# EasyEDA Pro project pcb入门（R标哨兵小周边）.epro

# Schematic Schematic2
Board Name: 上板; Create Date: 2024-09-23; Page Name: P1; Project Name: 新生培训——pcb入门（装甲板小周边）; Schematic Name: Schematic2; Update Date: 2024-09-23; Company: 嘉立创EDA; Page Size: A4; Version: V1.0
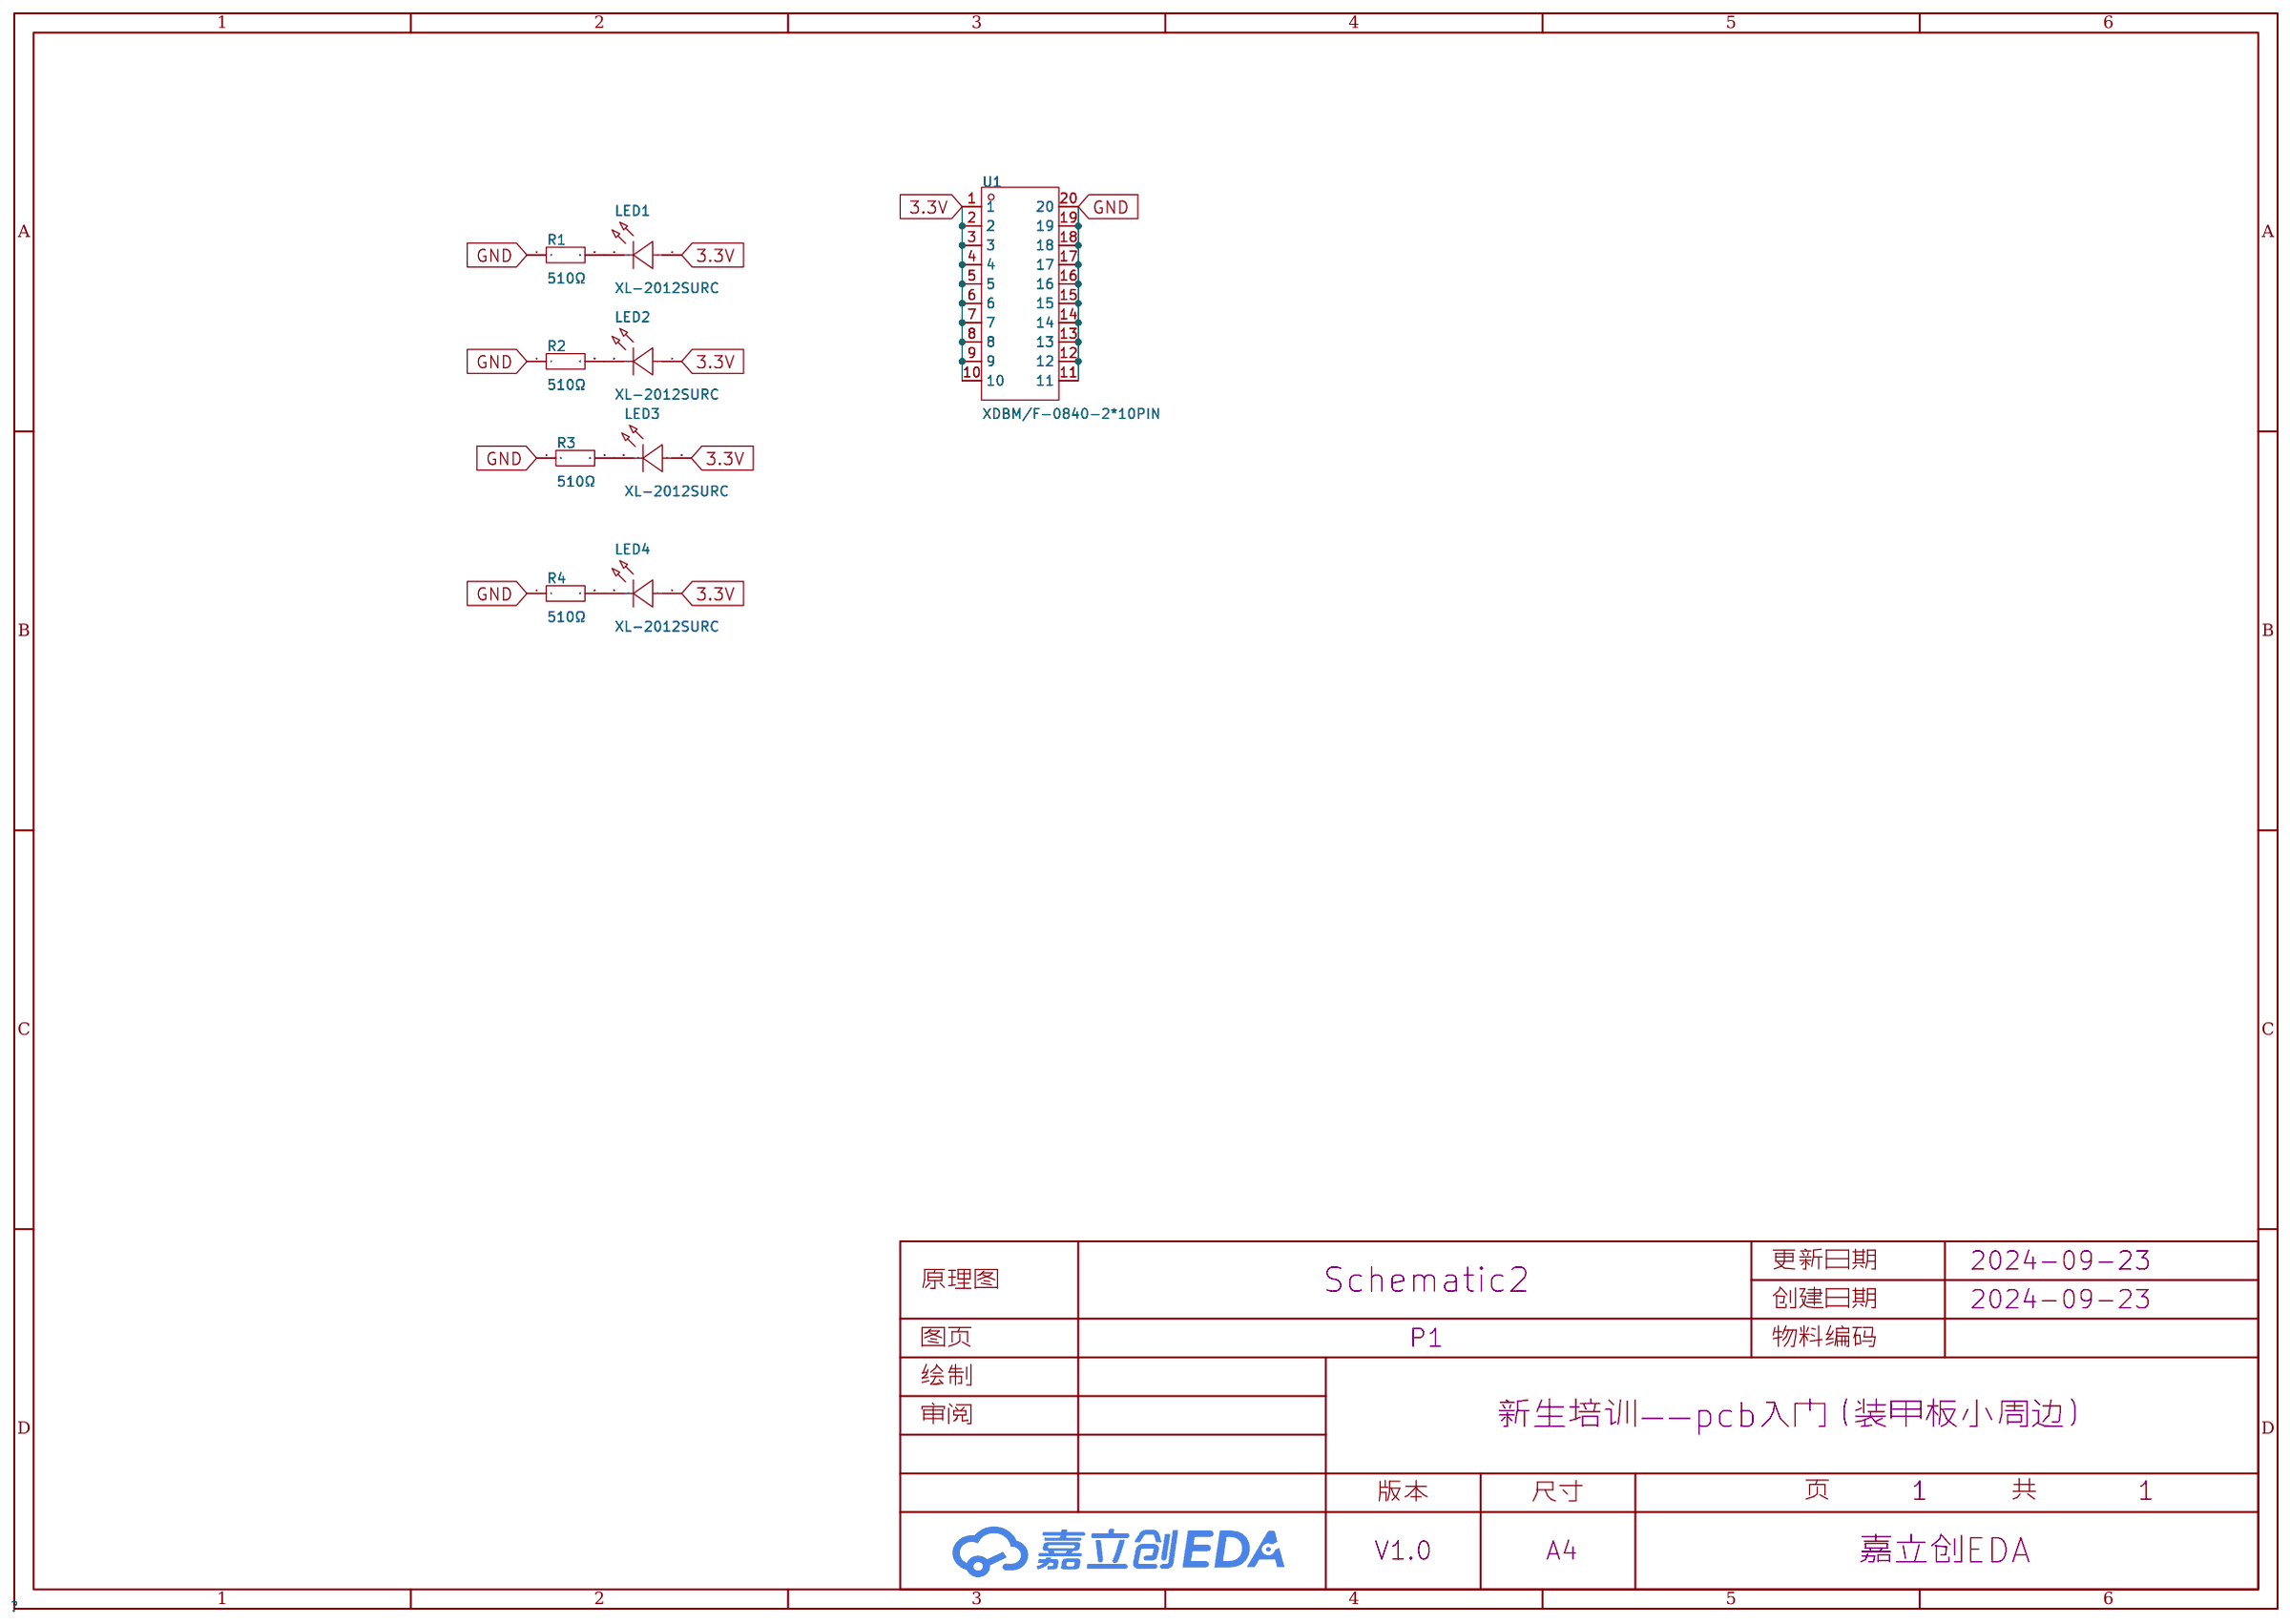
[diagram p0: schematic sheet]

## Parts
LED1  XL-2012SURC  [LED0805-R-RD]
LED2  XL-2012SURC  [LED0805-R-RD]
LED3  XL-2012SURC  [LED0805-R-RD]
LED4  XL-2012SURC  [LED0805-R-RD]
R1  510Ω  [R0805]
R2  510Ω  [R0805]
R3  510Ω  [R0805]
R4  510Ω  [R0805]
U1  XDBM/F-0840-2*10PIN  [CONN-SMD_20P-P0.80_LB340G20SBOR]

## Library data of the parts
LED1-LED4 = XL-2012SURC: 发光颜色:红色;功率:55mW;正向电流:25mA;主波长:617nm~621nm;透镜颜色:无色透明透镜;色温:-;发光角度:120°;载带方式:正贴;工作温度:-30℃~+85℃;; Supplier Part: C965812; Manufacturer: XINGLIGHT(成兴光); Supplier Footprint: 0805; JLCPCB Part Class: 扩展库; Datasheet: https://atta.szlcsc.com/upload/public/pdf/source/20221102/49E1A0A365644091E6270AF1C5E0FE37.pdf; Supplier: LCSC; Emitted Color: 红色; Power Dissipation: 55mW; Forward Current: 25mA; Dominant Wavelength: 617nm~621nm; Peak Wavelength: 623nm; Lens Color: 无色透明透镜; Viewing Angle: 120°; Mounting Sytle: 正贴; Operating Temperature: -30℃~+85℃
R1-R4 = 0805W8F5100T5E: 电阻类型:厚膜电阻;阻值:510Ω;精度:±1%;功率:125mW;最大工作电压:150V;温度系数:±100ppm/℃;; LCSC Part Name: 510Ω ±1% 125mW 厚膜电阻; Supplier Part: C17734; Manufacturer: UNI-ROYAL(厚声); Supplier Footprint: 0805; JLCPCB Part Class: 基础库; Datasheet: https://atta.szlcsc.com/upload/public/pdf/source/20200306/C422600_1E6D84923E4A46A82E41ADD87F860B5C.pdf; Supplier: LCSC; Type: 厚膜电阻; Tolerance: ±1%; Power(Watts): 125mW; Overload Voltage (Max): 150V; Temperature Coefficient: ±100ppm/℃; Operating Temperature Range: -55℃~+155℃
U1 = XDBM/F-0840-2*10PIN: PIN总数:20P;间距:0.8mm;安装方式:立贴;行数:2;额定电流:500mA;工作温度范围:-45℃~+80℃;; LCSC Part Name: 板对板连接器@@BTB板对板PH0.8-2*10PIN公母座合高4.0MM 二件套 2件套; Supplier Part: C19626263; Manufacturer: LX(连欣科技); Supplier Footprint: SMD,P=0.8mm; JLCPCB Part Class: Extended Part; Datasheet: https://atta.szlcsc.com/upload/public/pdf/source/20231208/7FD466011FDB41C6190E2B65EF865205.pdf; Supplier: LCSC; Number of Pins: 20P; Pitch: 0.8mm; Mounting Style: 立贴; Number of Rows: 2; Current Rating (Max): 500mA; Contact Material: 铜; Contact Plating: 金; Operating Temperature Range: -45℃~+80℃

## Nets
3.3V: LED1.1(A) LED2.1(A) LED3.1(A) LED4.1(A) U1.1 U1.2 U1.3 U1.4 U1.5 U1.6 U1.7 U1.8 U1.9 U1.10
GND: R1.1 R2.1 R3.1 R4.1 U1.11 U1.12 U1.13 U1.14 U1.15 U1.16 U1.17 U1.18 U1.19 U1.20
$1N489: LED1.2(K) R1.2
$1N651: LED2.2(K) R2.2
$1N756: LED3.2(K) R3.2
$1N861: LED4.2(K) R4.2

# Schematic Schematic1
Board Name: 下板; Create Date: 2024-09-08; Page Name: P1; Project Name: 新生培训——pcb入门（装甲板小周边）; Schematic Name: Schematic1; Update Date: 2024-09-23; Company: 嘉立创EDA; Page Size: A4; Version: V1.0
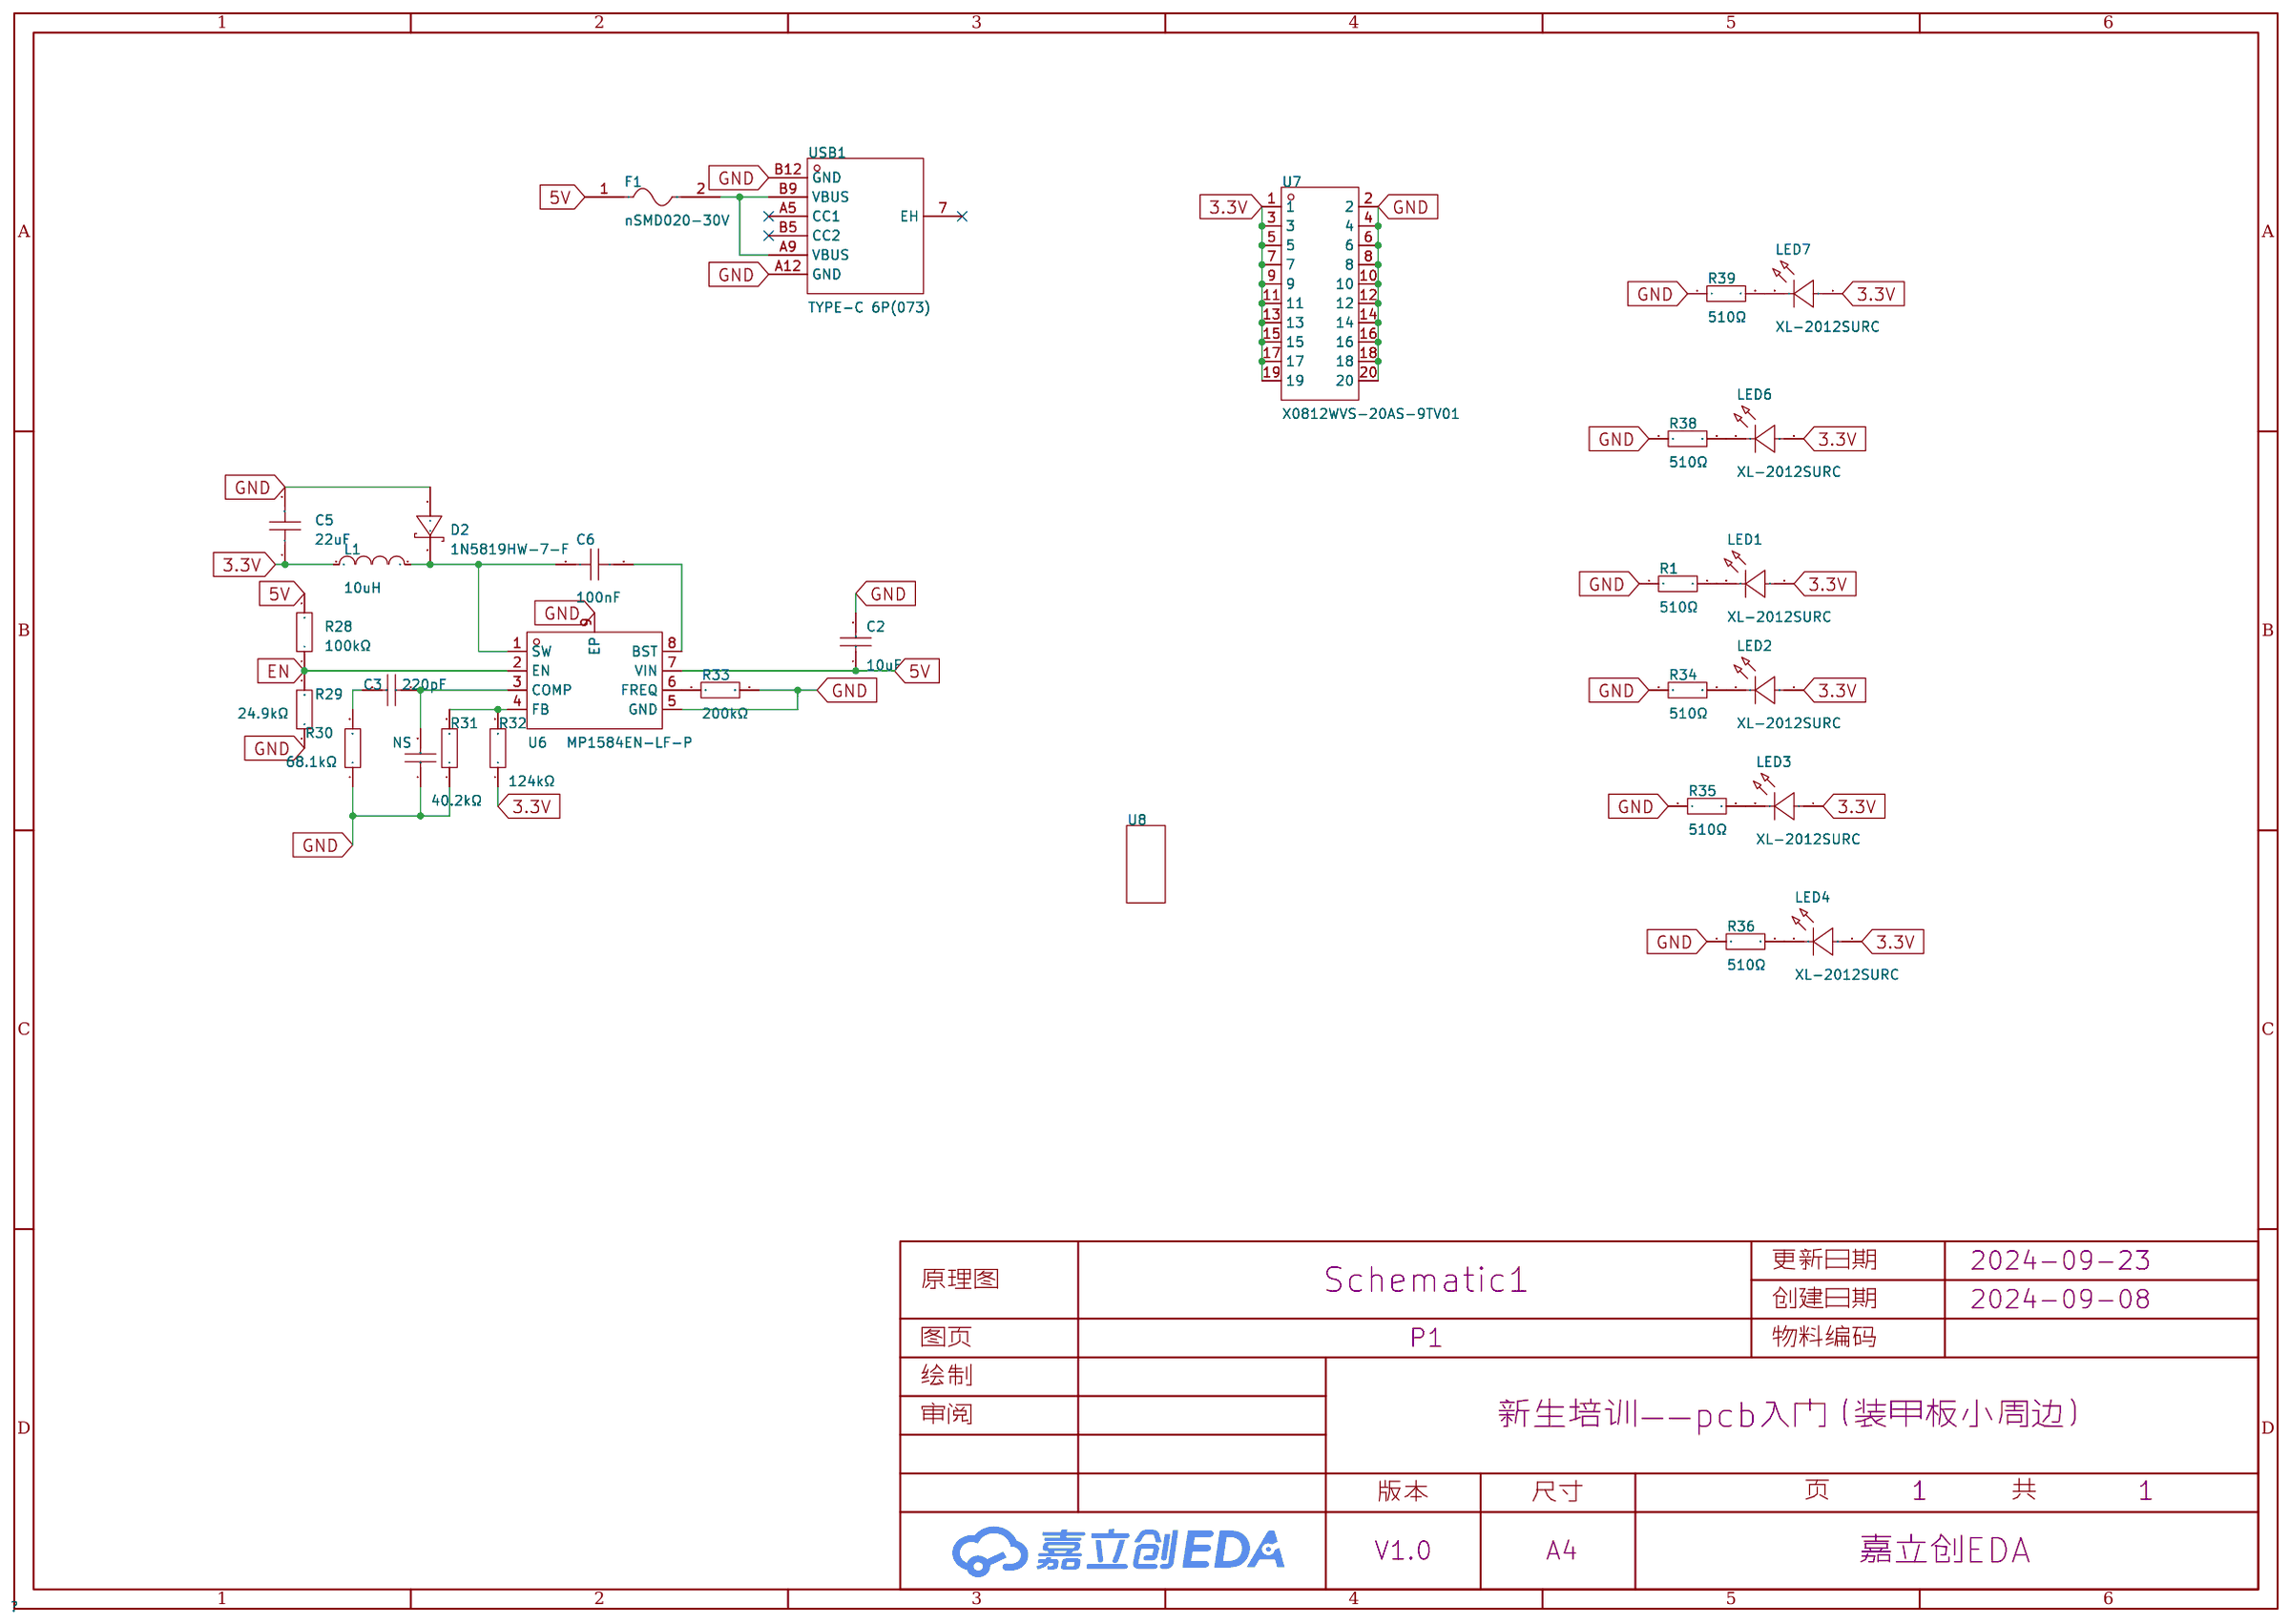
[diagram p1: schematic sheet]

## Parts
C2  10uF  [C0805]
C3  220pF  [C0805]
C4  NS  [C0805]
C5  22uF  [C0805]
C6  100nF  [C0805]
D2  1N5819HW-7-F  [SOD-123_L2.7-W1.6-LS3.7-RD]
F1  nSMD020-30V  [F1206]
L1  10uH  [IND-SMD_L4.4-W4.2]
LED1  XL-2012SURC  [LED0805-R-RD]
LED2  XL-2012SURC  [LED0805-R-RD]
LED3  XL-2012SURC  [LED0805-R-RD]
LED4  XL-2012SURC  [LED0805-R-RD]
LED6  XL-2012SURC  [LED0805-R-RD]
LED7  XL-2012SURC  [LED0805-R-RD]
R1  510Ω  [R0805]
R28  100kΩ  [R0805]
R29  24.9kΩ  [R0805]
R30  68.1kΩ  [R0805]
R31  40.2kΩ  [R0805]
R32  124kΩ  [R0805]
R33  200kΩ  [R0805]
R34  510Ω  [R0805]
R35  510Ω  [R0805]
R36  510Ω  [R0805]
R38  510Ω  [R0805]
R39  510Ω  [R0805]
U6  MP1584EN-LF-P  [SOIC-8_L4.9-W3.9-P1.27-LS6.0-TL-EP-1]
U7  X0812WVS-20AS-9TV01  [CONN-SMD_20P-P0.80_XKB_X0812WVS-20AS-9TV01]
U8  -  [周边上板]
USB1  TYPE-C 6P(073)  [TYPE-C-SMD_TYPE-C-6P_5]

## Library data of the parts
C2 = CL21A106KPFNNNE: 容值:10uF;精度:±10%;额定电压:10V;材质(温度系数):X5R;; LCSC Part Name: 10uF ±10% 10V; Supplier Part: C17024; Manufacturer: SAMSUNG(三星); Supplier Footprint: 0805; JLCPCB Part Class: 扩展库; Datasheet: https://atta.szlcsc.com/upload/public/pdf/source/20160218/1457707763339.pdf; Supplier: LCSC; Tolerance: ±10%; Voltage Rated: 10V; Temperature Coefficient: X5R
C3 C4 = CC0805KRX7R9BB221: 容值:220pF;精度:±10%;额定电压:50V;材质(温度系数):X7R;; LCSC Part Name: 220pF ±10% 50V; Supplier Part: C107145; Manufacturer: YAGEO(国巨); Supplier Footprint: 0805; JLCPCB Part Class: 基础库; Datasheet: https://atta.szlcsc.com/upload/public/pdf/source/20170914/C128857_1505359892143968080.pdf; Supplier: LCSC; Tolerance: ±10%; Voltage Rated: 50V; Temperature Coefficient: X7R
C5 = CGA0805X5R226M350MT: 容值:22uF;精度:±20%;额定电压:35V;材质(温度系数):X5R;; LCSC Part Name: 22uF ±20% 35V; Supplier Part: C6119901; Manufacturer: HRE(芯声); Supplier Footprint: 0805; JLCPCB Part Class: 扩展库; Datasheet: https://atta.szlcsc.com/upload/public/pdf/source/20231129/D589D0CC4D260F7AC3A77E53B455CCB3.pdf; Supplier: LCSC; Tolerance: ±20%; Voltage Rated: 35V; Temperature Coefficient: X5R
C6 = CC0805KRX7R9BB104: 容值:100nF;精度:±10%;额定电压:50V;材质(温度系数):X7R;; LCSC Part Name: 100nF ±10% 50V; Supplier Part: C49678; Manufacturer: YAGEO(国巨); Supplier Footprint: 0805; JLCPCB Part Class: 基础库; Datasheet: https://atta.szlcsc.com/upload/public/pdf/source/20180224/C181747_15194369449651363981.pdf; Supplier: LCSC; Tolerance: ±10%; Voltage Rated: 50V; Temperature Coefficient: X7R
D2 = 1N5819HW-7-F: 正向压降(Vf):450mV@1A;直流反向耐压(Vr):40V;平均整流电流(Io):1A;; LCSC Part Name: 电压:40V 电流:1A; Supplier Part: C82544; Manufacturer: DIODES(美台); Supplier Footprint: SOD-123; JLCPCB Part Class: 扩展库; Datasheet: https://atta.szlcsc.com/upload/public/pdf/source/20161024/1477288459223.pdf; Supplier: LCSC; Forward Voltage (Vf@If): 450mV@1A; Reverse Voltage (Vr): 40V; Average Rectified Current (Io): 1A; Reverse Leakage Current (Ir): 1mA@40V
F1 = nSMD020-30V: 最大电压:30V;最大电流:100A;保持电流:200mA;跳闸电流:460mA;; LCSC Part Name: 30V 200mA 1206自恢复; Supplier Part: C69680; Manufacturer: 台湾陆海; Supplier Footprint: 1206; JLCPCB Part Class: 扩展库; Datasheet: https://atta.szlcsc.com/upload/public/pdf/source/20230404/9F5B471D89C649BCC2835D46521A6324.pdf; Supplier: LCSC; Operating Voltage (Max): 30V; Current Rating (Max): 100A; Hold Current: 200mA; Trip Current: 460mA
L1 = FXL0420-100-M: 电感值:10uH;精度:±20%;额定电流:1.6A;饱和电流(Isat):2.2A;类型:一体成型电感;; LCSC Part Name: 10uH ±20% 2.2A; Supplier Part: C177242; Manufacturer: cjiang(长江微电); Supplier Footprint: SMD,4.2x4.4mm; JLCPCB Part Class: 扩展库; Datasheet: https://atta.szlcsc.com/upload/public/pdf/source/20240426/3189EA8206330E2108542F9E34E540E7.pdf; Supplier: LCSC; Tolerance: ±20%; Rated Current: 1.6A; Saturation Current (Isat): 2.2A; DC Resistance (DCR): 282mΩ; Type: 一体成型电感
LED1-LED4 LED6 LED7 = XL-2012SURC: 发光颜色:红色;功率:55mW;正向电流:25mA;主波长:617nm~621nm;透镜颜色:无色透明透镜;色温:-;发光角度:120°;载带方式:正贴;工作温度:-30℃~+85℃;; Supplier Part: C965812; Manufacturer: XINGLIGHT(成兴光); Supplier Footprint: 0805; JLCPCB Part Class: 扩展库; Datasheet: https://atta.szlcsc.com/upload/public/pdf/source/20221102/49E1A0A365644091E6270AF1C5E0FE37.pdf; Supplier: LCSC; Emitted Color: 红色; Power Dissipation: 55mW; Forward Current: 25mA; Dominant Wavelength: 617nm~621nm; Peak Wavelength: 623nm; Lens Color: 无色透明透镜; Viewing Angle: 120°; Mounting Sytle: 正贴; Operating Temperature: -30℃~+85℃
R1 R34-R36 R38 R39 = 0805W8F5100T5E: 电阻类型:厚膜电阻;阻值:510Ω;精度:±1%;功率:125mW;最大工作电压:150V;温度系数:±100ppm/℃;; LCSC Part Name: 510Ω ±1% 125mW 厚膜电阻; Supplier Part: C17734; Manufacturer: UNI-ROYAL(厚声); Supplier Footprint: 0805; JLCPCB Part Class: 基础库; Datasheet: https://atta.szlcsc.com/upload/public/pdf/source/20200306/C422600_1E6D84923E4A46A82E41ADD87F860B5C.pdf; Supplier: LCSC; Type: 厚膜电阻; Tolerance: ±1%; Power(Watts): 125mW; Overload Voltage (Max): 150V; Temperature Coefficient: ±100ppm/℃; Operating Temperature Range: -55℃~+155℃
R28 = 0805W8F1003T5E: 电阻类型:厚膜电阻;阻值:100kΩ;精度:±1%;功率:125mW;最大工作电压:150V;温度系数:±100ppm/℃;; LCSC Part Name: 100kΩ ±1% 125mW 厚膜电阻; Supplier Part: C149504; Manufacturer: UNI-ROYAL(厚声); Supplier Footprint: 0805; JLCPCB Part Class: 基础库; Datasheet: https://atta.szlcsc.com/upload/public/pdf/source/20200306/C422600_1E6D84923E4A46A82E41ADD87F860B5C.pdf; Supplier: LCSC; Type: 厚膜电阻; Tolerance: ±1%; Power(Watts): 125mW; Overload Voltage (Max): 150V; Temperature Coefficient: ±100ppm/℃; Operating Temperature Range: -55℃~+155℃
R29 = 0805W8F2492T5E: 电阻类型:厚膜电阻;阻值:24.9kΩ;精度:±1%;功率:125mW;最大工作电压:150V;温度系数:±100ppm/℃;; LCSC Part Name: 24.9kΩ ±1% 125mW 厚膜电阻; Supplier Part: C17571; Manufacturer: UNI-ROYAL(厚声); Supplier Footprint: 0805; JLCPCB Part Class: 扩展库; Datasheet: https://atta.szlcsc.com/upload/public/pdf/source/20200306/C422600_1E6D84923E4A46A82E41ADD87F860B5C.pdf; Supplier: LCSC; Type: 厚膜电阻; Tolerance: ±1%; Power(Watts): 125mW; Overload Voltage (Max): 150V; Temperature Coefficient: ±100ppm/℃; Operating Temperature Range: -55℃~+155℃
R30 = 0805W8F6812T5E: 电阻类型:厚膜电阻;阻值:68.1kΩ;精度:±1%;功率:125mW;最大工作电压:150V;温度系数:±100ppm/℃;; LCSC Part Name: 68.1kΩ ±1% 125mW 厚膜电阻; Supplier Part: C17795; Manufacturer: UNI-ROYAL(厚声); Supplier Footprint: 0805; JLCPCB Part Class: 扩展库; Datasheet: https://atta.szlcsc.com/upload/public/pdf/source/20200306/C422600_1E6D84923E4A46A82E41ADD87F860B5C.pdf; Supplier: LCSC; Type: 厚膜电阻; Tolerance: ±1%; Power(Watts): 125mW; Overload Voltage (Max): 150V; Temperature Coefficient: ±100ppm/℃; Operating Temperature Range: -55℃~+155℃
R31 = 0805W8F4022T5E: 电阻类型:厚膜电阻;阻值:40.2kΩ;精度:±1%;功率:125mW;最大工作电压:150V;温度系数:±100ppm/℃;; LCSC Part Name: 40.2kΩ ±1% 125mW 厚膜电阻; Supplier Part: C17678; Manufacturer: UNI-ROYAL(厚声); Supplier Footprint: 0805; JLCPCB Part Class: 扩展库; Datasheet: https://atta.szlcsc.com/upload/public/pdf/source/20200306/C422600_1E6D84923E4A46A82E41ADD87F860B5C.pdf; Supplier: LCSC; Type: 厚膜电阻; Tolerance: ±1%; Power(Watts): 125mW; Overload Voltage (Max): 150V; Temperature Coefficient: ±100ppm/℃; Operating Temperature Range: -55℃~+155℃
R32 = 0805W8F1243T5E: 电阻类型:厚膜电阻;阻值:124kΩ;精度:±1%;功率:125mW;最大工作电压:150V;温度系数:±100ppm/℃;; LCSC Part Name: 124kΩ ±1% 125mW 厚膜电阻; Supplier Part: C17440; Manufacturer: UNI-ROYAL(厚声); Supplier Footprint: 0805; JLCPCB Part Class: 扩展库; Datasheet: https://atta.szlcsc.com/upload/public/pdf/source/20200306/C422600_1E6D84923E4A46A82E41ADD87F860B5C.pdf; Supplier: LCSC; Type: 厚膜电阻; Tolerance: ±1%; Power(Watts): 125mW; Overload Voltage (Max): 150V; Temperature Coefficient: ±100ppm/℃; Operating Temperature Range: -55℃~+155℃
R33 = 0805W8F2003T5E: 电阻类型:厚膜电阻;阻值:200kΩ;精度:±1%;功率:125mW;最大工作电压:150V;温度系数:±100ppm/℃;; LCSC Part Name: 200kΩ ±1% 125mW 厚膜电阻; Supplier Part: C17539; Manufacturer: UNI-ROYAL(厚声); Supplier Footprint: 0805; JLCPCB Part Class: 基础库; Datasheet: https://atta.szlcsc.com/upload/public/pdf/source/20200306/C422600_1E6D84923E4A46A82E41ADD87F860B5C.pdf; Supplier: LCSC; Type: 厚膜电阻; Tolerance: ±1%; Power(Watts): 125mW; Overload Voltage (Max): 150V; Temperature Coefficient: ±100ppm/℃; Operating Temperature Range: -55℃~+155℃
U6 = MP1584EN-LF-P: 功能类型:降压型;输出类型:可调;输入电压:4.5V~28V;输出电压:800mV~25V;输出电流(最大值):3A;; Supplier Part: C7304223; Manufacturer: MPS(芯源); Supplier Footprint: SOIC-8-EP; JLCPCB Part Class: 扩展库; Datasheet: https://atta.szlcsc.com/upload/public/pdf/source/20240130/9891F7686D244BAC2C15FBD735CECA53.pdf; Supplier: LCSC; Function: 降压型; Output Type: 可调; Input Voltage: 4.5V~28V; Output Voltage: 800mV~25V; Output Current (Max): 3A; Switching Frequency: 1.5MHz; Operating Temperature: -20℃~+125℃@(TJ); Synchronous Rectification: 否; Number of Outputs: 1; Topology: 降压式; Switch tube (built-in/external): 内置
U7 = X0812WVS-20AS-9TV01: 间距:0.8mm;公母:公;; LCSC Part Name: 间距:0.8mm 公; Supplier Part: C5138047; Manufacturer: XKB Connectivity(中国星坤); Supplier Footprint: SMD,P=0.8mm; JLCPCB Part Class: 扩展库; Datasheet: https://atta.szlcsc.com/upload/public/pdf/source/20220816/F33CDF2C099D0D442F3D79A3B2A2DA3A.pdf; Supplier: LCSC; Pitch: 0.8mm; Gender: 公
U8 = 周边上板: 新生培训pcb上板
USB1 = TYPE-C 6P(073): 连接器类型:Type-C;标准:USB 3.1;公母:母;安装方式:卧贴;触点数量:6P;端口数量:1;额定电流 - 电源:3A;工作温度范围:-25℃~+85℃;; LCSC Part Name: Type-C 母 卧贴; Supplier Part: C668623; Manufacturer: SHOU HAN(首韩); Supplier Footprint: SMD; JLCPCB Part Class: 扩展库; Datasheet: https://atta.szlcsc.com/upload/public/pdf/source/20200618/C668623_A4B260DED7AC1949BAC6AE39E9F4CD80.pdf; Supplier: LCSC; Connector Type: Type-C; Standard: USB 3.1; Gender: 母; Mounting Style: 卧贴; Number of Contacts: 6P; Number of Ports: 1; Current Rating - Power (Max): 3A; Operating Temperature Range: -25℃~+85℃; Rated Voltage (Max): 5V; Connect-Disconnect Life: 1万次; Core Colour: 黑色

## Nets
3.3V: C5.1 L1.1 LED1.1(A) LED2.1(A) LED3.1(A) LED4.1(A) LED6.1(A) LED7.1(A) R32.1 U7.1 U7.3 U7.5 U7.7 U7.9 U7.11 U7.13 U7.15 U7.17 U7.19
5V: C2.1 F1.1 R28.2 U6.7(VIN)
GND: C2.2 C4.1 C5.2 D2.2(A) R1.1 R29.1 R30.1 R31.1 R33.2 R34.1 R35.1 R36.1 R38.1 R39.1 U6.5(GND) U6.9(EP) U7.2 U7.4 U7.6 U7.8 U7.10 U7.12 U7.14 U7.16 U7.18 U7.20 USB1.A12(GND) USB1.B12(GND)
EN: R28.1 R29.2 U6.2(EN)
$1N1098: C6.2 U6.8(BST)
$1N1103: C6.1 D2.1(K) L1.2 U6.1(SW)
$1N1571: C3.2 C4.2 U6.3(COMP)
$1N1610: C3.1 R30.2
$1N1761: R31.2 R32.2 U6.4(FB)
$1N2190: R33.1 U6.6(FREQ)
$1N3372: F1.2 USB1.A9(VBUS) USB1.B9(VBUS)
$1N3585: LED1.2(K) R1.2
$1N3719: LED2.2(K) R34.2
$1N3821: LED3.2(K) R35.2
$1N3923: LED4.2(K) R36.2
$1N4127: LED6.2(K) R38.2
$1N4229: LED7.2(K) R39.2

Not connected (* = marked no-connect by the designer): USB1 7(EH)* A5(CC1)* B5(CC2)*

# Board PCB1
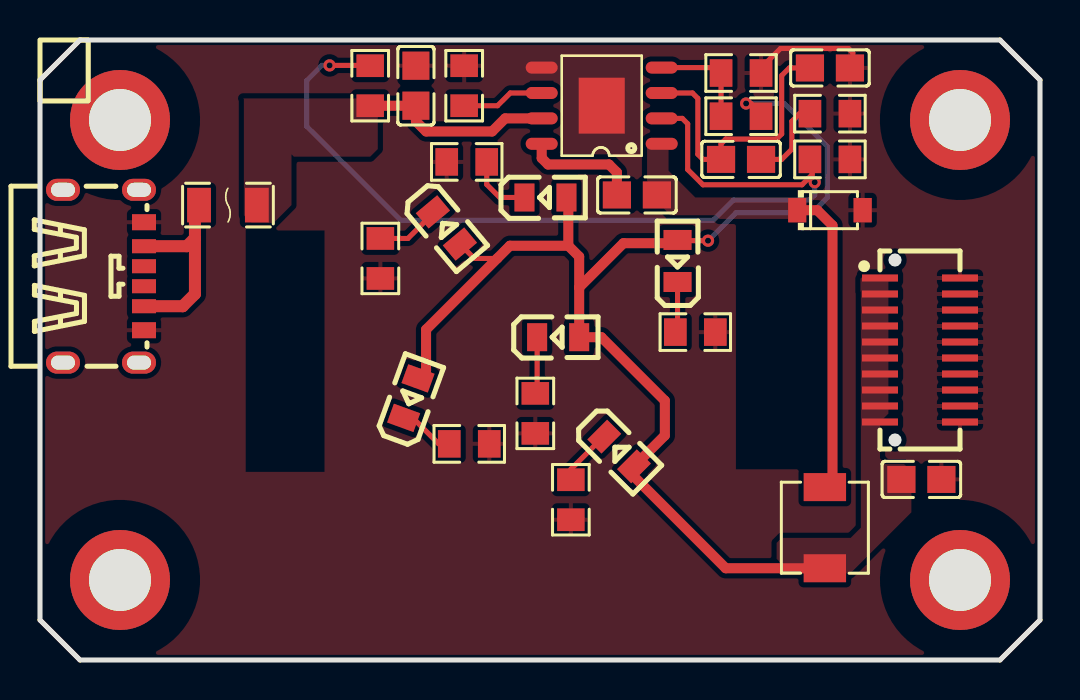
[diagram p2: board, top side]
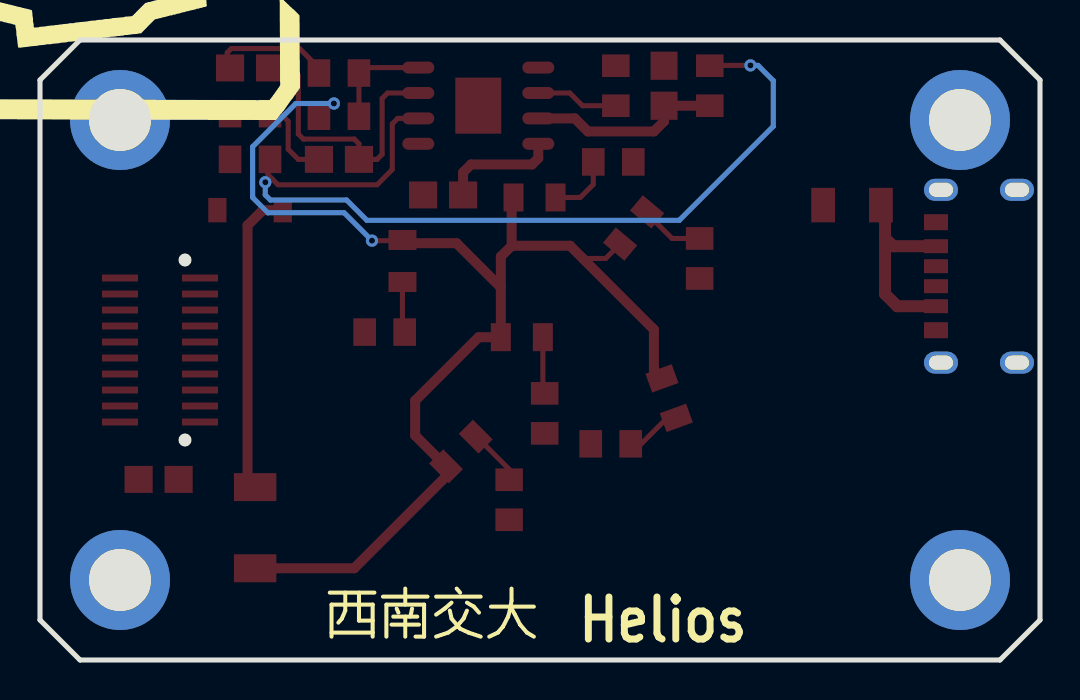
[diagram p3: board, bottom side, seen from below]

Outline 50 x 31 mm; copper layers: Top Layer, Bottom Layer. Coordinates in mm from the lower left corner of the outline.
Outline path: 0,29 0,2 2,0 48,0 50,2 50,29 48,31 2,31 0,29
Stack: Top Layer 0.035mm / Dielectric1 1.51mm FR4 er 4.5 / Bottom Layer 0.035mm

## Design rules (mm)
template: JLCPCB Capability(Two Layers Board)
spacing copperThickness1oz (default): track to track 0.102, other pairs 0.152 to 0.3
spacing copperThickness2oz: track to track 0.203, other pairs 0.152 to 0.3
track width copperThickness1oz (default): min 0.127, default 0.254, max 2.54
track width copperThickness2oz: min 0.203, default 0.254, max 2.54
differential pair differentialPair (default): width min 0.127, default 0.254, max 2.54; gap min 0.152, default 0.152
via viaSize (default): diameter min 0.5, default 0.61, max 10; hole min 0.3, default 0.305, max 6.3

## Placement (name value [footprint] x y rotation side)
C2  10uF  [C0805]  18.8 28.71 90 top
C3  220pF  [C0805]  35.05 25.03 180 top
C4  NS  [C0805]  39.5 29.6 180 top
C5  22uF  [C0805]  44.07 9.03 0 top
C6  100nF  [C0805]  29.84 23.25 180 top
D2  1N5819HW-7-F  [SOD-123_L2.7-W1.6-LS3.7-RD]  39.5 22.49 0 top
F1  nSMD020-30V  [F1206]  9.4 22.74 180 top
L1  10uH  [IND-SMD_L4.4-W4.2]  39.24 6.62 270 top
LED1  XL-2012SURC  [LED0805-R-RD]  20.32 21.6 310 top
LED2  XL-2012SURC  [LED0805-R-RD]  31.88 19.95 90 top
LED3  XL-2012SURC  [LED0805-R-RD]  18.54 13.09 70 top
LED4  XL-2012SURC  [LED0805-R-RD]  28.96 10.43 315 top
LED6  XL-2012SURC  [LED0805-R-RD]  25.91 16.14 0 top
LED7  XL-2012SURC  [LED0805-R-RD]  25.27 23.13 0 top
NOREF  -  [Pad_e46]  4 27 0 top
NOREF#2  -  [Pad_e49]  4 4 0 top
NOREF#3  -  [Pad_e48]  46 27 0 top
NOREF#4  -  [Pad_e50]  46 4 0 top
R1  510Ω  [R0805]  17.02 20.08 90 top
R28  100kΩ  [R0805]  16.51 28.71 270 top
R29  24.9kΩ  [R0805]  39.5 25.03 180 top
R30  68.1kΩ  [R0805]  39.5 27.32 180 top
R31  40.2kΩ  [R0805]  35.05 29.35 180 top
R32  124kΩ  [R0805]  35.05 27.19 180 top
R33  200kΩ  [R0805]  21.21 28.71 90 top
R34  510Ω  [R0805]  32.77 16.39 180 top
R35  510Ω  [R0805]  21.46 10.81 180 top
R36  510Ω  [R0805]  26.54 8.01 90 top
R38  510Ω  [R0805]  24.77 12.33 90 top
R39  510Ω  [R0805]  21.34 24.9 0 top
U6  MP1584EN-LF-P  [SOIC-8_L4.9-W3.9-P1.27-LS6.0-TL-EP-1]  28.07 27.7 180 top
U7  X0812WVS-20AS-9TV01  [CONN-SMD_20P-P0.80_XKB_X0812WVS-20AS-9TV01]  44 15.5 270 top
U8  -  [周边上板]  0 31 0 top
USB1  TYPE-C 6P(073)  [TYPE-C-SMD_TYPE-C-6P_5]  3.17 19.19 270 top

## Footprints (pads in the part's own frame, mm; a bottom-side part is the same pattern mirrored in y, then rotated)
C0805
  rect 1.41x1.35 smd: 1(-1,0) 2(1,0)
CONN-SMD_20P-P0.80_XKB_X0812WVS-20AS-9TV01
  rect 0.35x1.8 smd: 1(-3.6,-2) 2(-3.6,2) 3(-2.8,-2) 4(-2.8,2) 5(-2,-2) 6(-2,2) 7(-1.2,-2) 8(-1.2,2) 9(-0.4,-2) 10(-0.4,2) 11(0.4,-2) 12(0.4,2) 13(1.2,-2) 14(1.2,2) 15(2,-2) 16(2,2) 17(2.8,-2) 18(2.8,2) 19(3.6,-2) 20(3.6,2)
F1206
  rect 1.19x1.728 smd: 1(-1.445,0) 2(1.445,0)
IND-SMD_L4.4-W4.2
  rect 1.4x2.12 smd: 1(2.028,0) 2(-2.028,0)
LED0805-R-RD
  rect 1x1.399 smd: 1(1.05,0) 2(-1.05,0)
Pad_e46
  round 5 hole 3.1: 1(0,0)
Pad_e48
  round 5 hole 3.1: 1(0,0)
Pad_e49
  round 5 hole 3.1: 1(0,0)
Pad_e50
  round 5 hole 3.1: 1(0,0)
R0805
  rect 1.133x1.377 smd: 1(-1,0) 2(1,0)
SOD-123_L2.7-W1.6-LS3.7-RD
  rect 0.91x1.22 smd: 1(-1.635,0) 2(1.635,0)
SOIC-8_L4.9-W3.9-P1.27-LS6.0-TL-EP-1
  oval 1.6x0.6 smd: 1(-3.018,1.887) 2(-3.018,0.617) 3(-3.018,-0.653) 4(-3.018,-1.923) 5(2.982,-1.923) 6(2.982,-0.653) 7(2.982,0.617) 8(2.982,1.887)
  rect 2.3x2.8 smd: 9(-0.018,-0.018)
TYPE-C-SMD_TYPE-C-6P_5
  oval 1.1x1.7 hole 0.7x1.2: 7(-4.32,1.775) 7(-4.32,-2.025) 7(4.32,1.775) 7(4.32,-2.025)
  rect 0.7x1.2 smd: A5(-0.5,2.025) A9(1.5,2.025) B5(0.5,2.025) B9(-1.5,2.025)
  rect 0.8x1.2 smd: A12(2.7,2.025) B12(-2.7,2.025)

## Nets
As in the schematic.

Pads without a net: NOREF 1; NOREF#2 1; NOREF#3 1; NOREF#4 1; USB1 7 A5 B5

## Via types
v1: diameter 0.61, hole 0.305, Top Layer to Bottom Layer, 4 vias

## Routing (per net, layer and track width the routed paths; a pad name or vN(x,y) marks a point on that pad's centre or on a via; arc(x,y) is an arc through that point)
3.3V: length 65.1
  Top Layer w0.254: 22.86,20.08 21.71,20.08 21,20.8 ; v1(35.31,27.82) 35.54,27.82 36.05,27.32 ; LED2.1 31.91,20.97 v1(33.4,20.97)
  Top Layer w0.5: 26.42,20.71 26.42,23.03 LED7.1 ; 26.42,20.71 26.96,20.17 26.96,18.63 ; 26.42,20.71 23.5,20.71 19.3,16.52 19.3,14.48 LED3.1 ; L1.1 34.29,4.59 29.7,9.18 LED4.1 31.24,11.23 31.24,12.97 28.07,16.14 LED6.1 26.96,18.63 ; 26.96,18.63 29.17,20.84 31.72,20.84 LED2.1
  Bottom Layer w0.254: v1(33.4,20.97) 34.8,22.36 38.61,22.36 39.37,23.13 39.37,25.67 37.21,27.82 v1(35.31,27.82)
5V: length 9.8
  Top Layer w0.5: U6.7 23.26,27.08 22.61,26.43 19.3,26.43 18.8,26.94 C2.1 R28.2
GND: length 5.9
  Top Layer w0.254: 36.05,29.6 37.02,30.57 40.43,30.57 40.64,30.36 40.64,29.75 C4.1
EN: length 46
  Top Layer w0.254: U6.2 32.11,27.08 32.38,26.81 32.38,24.52 33.15,23.76 38.1,23.76 38.38,24.04 ; R29.2 38.61,24.92 38.61,24.27 38.38,24.04 ; 38.38,24.04 38.59,24.04 v1(38.74,23.89) ; R28.1 16.49,29.73 v1(14.48,29.73)
  Bottom Layer w0.254: v1(38.74,23.89) 38.74,23.25 38.48,23 34.67,23 33.66,21.98 18.03,21.98 13.34,26.68 13.34,28.97 14.1,29.73 v1(14.48,29.73)
$1N1098: length 5.9
  Top Layer w0.5: U6.8 25.09,25.09 25.4,24.78 28.45,24.78 28.84,24.38 C6.2
$1N1103: length 15.5
  Top Layer w0.5: L1.2 39.5,8.64 39.62,8.77 39.62,21.73 38.86,22.49 D2.1
$1N1571: length 14.5
  Top Layer w0.254: C4.2 37.47,29.6 37.08,29.22 37.08,26.3 36.83,26.05 34.29,26.05 34.05,25.81 C3.2 33.15,25.03 32.89,25.28 32.89,28.08 32.62,28.35 U6.3
$1N1610: length 4.2
  Top Layer w0.254: C3.1 37.08,25.03 37.59,25.54 37.59,26.94 37.97,27.32 R30.2
$1N1761: length 5.3
  Top Layer w0.254: U6.4 34.03,29.62 34.05,29.6 34.05,27.32
$1N2190: length 4.1
  Top Layer w0.254: R33.1 22.88,27.71 23.51,28.35 U6.6
$1N3372: length 9.5
  Top Layer w0.6: 7.75,21.09 7.75,18.3 7.14,17.69 USB1.A9 ; 7.75,21.09 7.75,22.24 7.7,22.24 ; 7.75,21.09 7.34,20.69 USB1.B9
$1N3585: length 3.2
  Top Layer w0.254: 19.65,22.41 19.65,22.32 18.4,21.08 R1.2
$1N3719: length 2.6
  Top Layer w0.254: LED2.2 31.88,16.51 R34.2
$1N3821: length 2.8
  Top Layer w0.254: R35.2 19.94,10.81 18.64,12.11 LED3.2
$1N3923: length 2.9
  Top Layer w0.254: LED4.2 28.17,11.17 26.54,9.54 R36.2
$1N4127: length 2.8
  Top Layer w0.254: LED6.2 24.86,13.42 R38.2
$1N4229: length 3.3
  Top Layer w0.254: R39.2 22.34,23.78 22.99,23.13 LED7.2

## Copper pours and planes (outline as drawn; the poured copper is in the pictures)
3.3V on Top Layer: 36.83,19.19 43.57,19.19 43.57,4.34 36.83,4.34
5V on Top Layer: 10.16,28.08 16.89,28.08 16.89,21.86 10.16,21.86
GND on Top Layer: 26.54,30.11 29.74,30.11 29.74,25.59 26.54,25.59
GND on Top Layer: 23.37,30.49 27.31,30.49 27.31,28.97 23.37,28.97
GND on Top Layer: -5.59,34.68 60.33,34.68 60.33,-6.97 -5.59,-6.97
$1N1103 on Top Layer: 30.35,25.92 38.04,25.92 38.04,22.05 30.35,22.05

## Text on the board
Bottom Silkscreen Layer: Helios | 西南交大

# Board PCB2
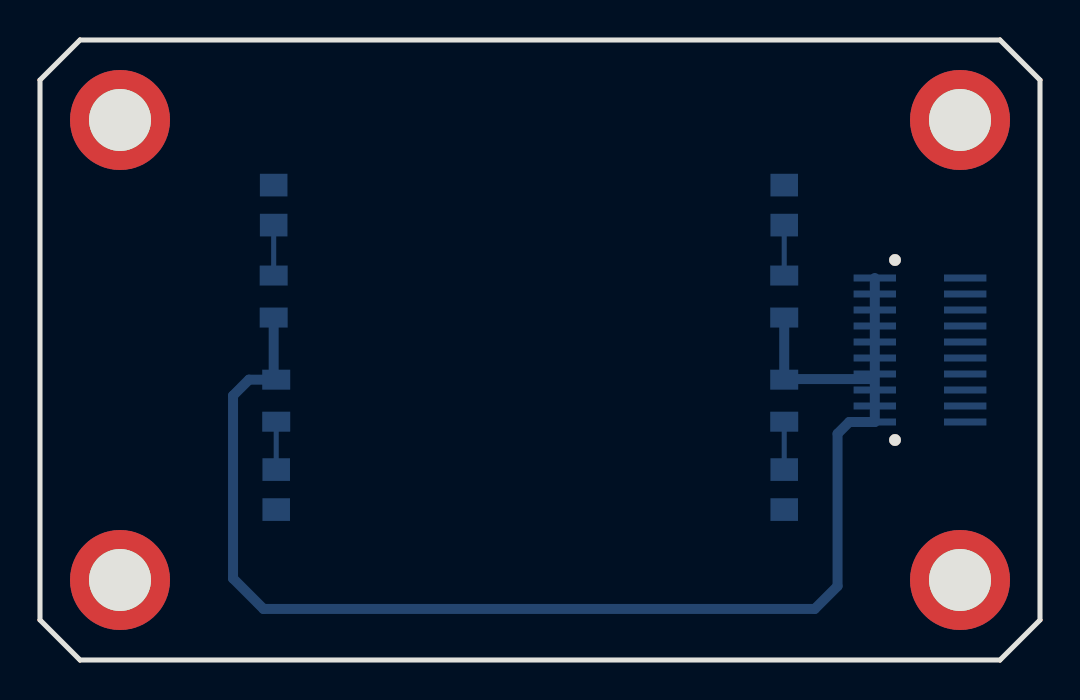
[diagram p4: board, top side]
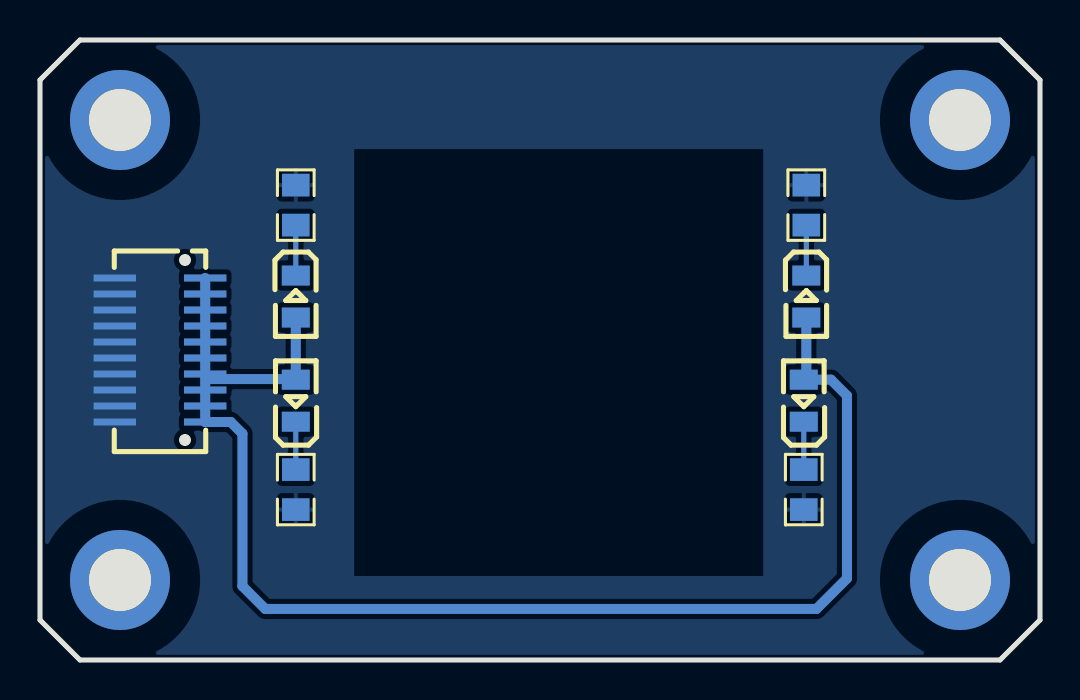
[diagram p5: board, bottom side, seen from below]

Outline 50 x 31 mm; copper layers: Top Layer, Bottom Layer. Coordinates in mm from the lower left corner of the outline.
Outline path: 0,29 0,2 2,0 48,0 50,2 50,29 48,31 2,31 0,29
Stack: Top Layer 0.035mm / Dielectric1 1.51mm FR4 er 4.5 / Bottom Layer 0.035mm

## Design rules (mm)
template: JLCPCB Capability(Two Layers Board)
spacing copperThickness1oz (default): track to track 0.102, other pairs 0.152 to 0.3
spacing copperThickness2oz: track to track 0.203, other pairs 0.152 to 0.3
track width copperThickness1oz (default): min 0.127, default 0.254, max 2.54
track width copperThickness2oz: min 0.203, default 0.254, max 2.54
differential pair differentialPair (default): width min 0.127, default 0.254, max 2.54; gap min 0.152, default 0.152
via viaSize (default): diameter min 0.5, default 0.61, max 10; hole min 0.3, default 0.305, max 6.3

## Placement (name value [footprint] x y rotation side)
LED1  XL-2012SURC  [LED0805-R-RD]  11.68 18.17 270 bottom
LED2  XL-2012SURC  [LED0805-R-RD]  11.81 12.97 90 bottom
LED3  XL-2012SURC  [LED0805-R-RD]  37.21 18.17 270 bottom
LED4  XL-2012SURC  [LED0805-R-RD]  37.21 12.97 90 bottom
NOREF  -  [Pad_e21]  4 4 0 top
NOREF#2  -  [Pad_e23]  46 4 0 top
NOREF#3  -  [Pad_e17]  4 27 0 top
NOREF#4  -  [Pad_e22]  46 27 0 top
R1  510Ω  [R0805]  11.68 22.74 270 bottom
R2  510Ω  [R0805]  11.81 8.52 90 bottom
R3  510Ω  [R0805]  37.21 22.74 270 bottom
R4  510Ω  [R0805]  37.21 8.52 90 bottom
U1  XDBM/F-0840-2*10PIN  [CONN-SMD_20P-P0.80_LB340G20SBOR]  44 15.5 90 bottom

## Footprints (pads in the part's own frame, mm; a bottom-side part is the same pattern mirrored in y, then rotated)
CONN-SMD_20P-P0.80_LB340G20SBOR
  rect 0.35x2.12 smd: 1(-3.6,-2.26) 2(-2.8,-2.26) 3(-2,-2.26) 4(-1.2,-2.26) 5(-0.4,-2.26) 6(0.4,-2.26) 7(1.2,-2.26) 8(2,-2.26) 9(2.8,-2.26) 10(3.6,-2.26) 11(3.6,2.26) 12(2.8,2.26) 13(2,2.26) 14(1.2,2.26) 15(0.4,2.26) 16(-0.4,2.26) 17(-1.2,2.26) 18(-2,2.26) 19(-2.8,2.26) 20(-3.6,2.26)
LED0805-R-RD
  rect 1x1.399 smd: 1(1.05,0) 2(-1.05,0)
Pad_e17
  round 5 hole 3.1: 1(0,0)
Pad_e21
  round 5 hole 3.1: 1(0,0)
Pad_e22
  round 5 hole 3.1: 1(0,0)
Pad_e23
  round 5 hole 3.1: 1(0,0)
R0805
  rect 1.133x1.377 smd: 1(-1,0) 2(1,0)

## Nets
As in the schematic.

Pads without a net: NOREF 1; NOREF#2 1; NOREF#3 1; NOREF#4 1

## Routing (per net, layer and track width the routed paths; a pad name or vN(x,y) marks a point on that pad's centre or on a via; arc(x,y) is an arc through that point)
3.3V: length 70.8
  Bottom Layer w0.5: U1.4 41.49,14.05 37.62,14.05 37.59,14.02 LED4.1 LED3.1 ; U1.4 U1.3 U1.2 U1.1 40.46,11.9 39.88,11.31 39.88,3.69 38.73,2.55 11.18,2.55 9.65,4.08 9.65,13.22 10.45,14.02 LED2.1 11.68,14.14 LED1.1 ; U1.4 U1.5 U1.6 U1.7 U1.8 U1.9 U1.10
$1N489: length 2.5
  Bottom Layer w0.254: R1.2 LED1.2
$1N651: length 2.4
  Bottom Layer w0.254: LED2.2 R2.2
$1N756: length 2.5
  Bottom Layer w0.254: R3.2 LED3.2
$1N861: length 2.4
  Bottom Layer w0.254: LED4.2 R4.2

## Copper pours and planes (outline as drawn; the poured copper is in the pictures)
GND on Bottom Layer: -2.92,34.3 53.09,34.3 53.09,-5.19 -2.92,-5.19
GND on Bottom Layer: 44.45,19.7 48.51,19.7 48.51,10.81 44.45,10.81
